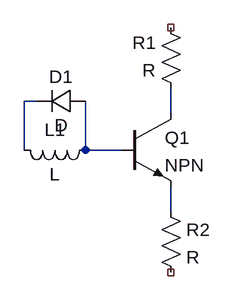
[diagram p0: schematic Draft6.asc]
Draft6.asc, the LTspice schematic file:
Version 4
SHEET 1 880 680
WIRE 16 128 0 128
WIRE 192 144 192 112
WIRE 0 192 0 128
WIRE 80 192 80 128
WIRE 128 192 80 192
WIRE 192 272 192 240
SYMBOL res 208 128 R180
WINDOW 0 36 76 Left 2
WINDOW 3 36 40 Left 2
SYMATTR InstName R1
SYMBOL npn 128 144 R0
SYMATTR InstName Q1
SYMBOL res 176 256 R0
SYMATTR InstName R2
SYMBOL ind 96 176 R90
WINDOW 0 5 56 VBottom 2
WINDOW 3 32 56 VTop 2
SYMATTR InstName L1
SYMBOL diode 80 112 R90
WINDOW 0 0 32 VBottom 2
WINDOW 3 32 32 VTop 2
SYMATTR InstName D1

The netlist it stands for:
* Draft6.asc
R1 N002 NC_01 R
Q1 N002 N003 N004 0 NPN
R2 N004 NC_02 R
L1 N003 N001 L
D1 N003 N001 D
.model D D
.lib standard.dio
.model NPN NPN
.model PNP PNP
.lib standard.bjt
.backanno
.end